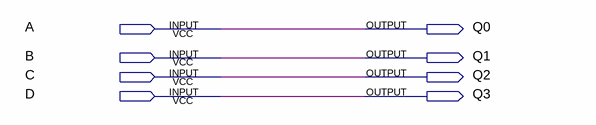
[diagram p0: schematic sheet]
// Quartus schematic ep1.bdf as structural Verilog: 0 symbols, 8 pins
module ep1 (
  input  A,
  input  B,
  input  C,
  input  D,
  output Q0,
  output Q1,
  output Q2,
  output Q3
);


  assign Q0 = A;
  assign Q1 = B;
  assign Q2 = C;
  assign Q3 = D;
endmodule
